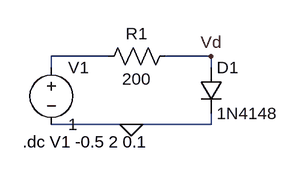
[diagram p0: schematic 9a.asc]
9a.asc, the LTspice schematic file:
Version 4
SHEET 1 880 680
WIRE 208 96 128 96
WIRE 352 96 288 96
WIRE 128 112 128 96
WIRE 352 112 352 96
WIRE 240 192 128 192
WIRE 352 192 352 176
WIRE 352 192 240 192
FLAG 240 192 0
FLAG 352 96 Vd
SYMBOL voltage 128 96 R0
WINDOW 123 0 0 Left 0
WINDOW 39 0 0 Left 0
SYMATTR InstName V1
SYMATTR Value 1
SYMBOL diode 336 112 R0
SYMATTR InstName D1
SYMATTR Value 1N4148
SYMBOL res 192 112 R270
WINDOW 0 32 56 VTop 2
WINDOW 3 0 56 VBottom 2
SYMATTR InstName R1
SYMATTR Value 200
TEXT 88 216 Left 2 !.dc V1 -0.5 2 0.1

The netlist it stands for:
* 9a.asc
V1 N001 0 1
D1 Vd 0 1N4148
R1 N001 Vd 200
.model D D
.lib standard.dio
.dc V1 -0.5 2 0.1
.backanno
.end